# Altium project PA_Channel.PrjPcb
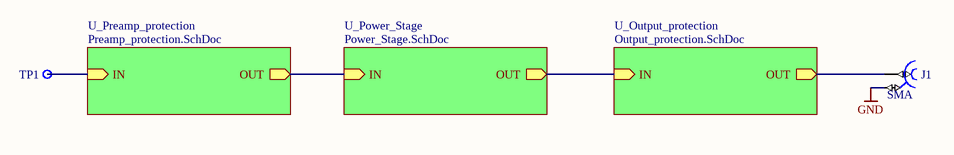
[diagram p0: PA_Channel.SchDoc]
4 sheets, 118 parts. Net scope: hierarchical (ports join the sheet entries above them; power ports are global).
Board file: PA_Channel_RF.PcbDoc
Sheets:
  PA_Channel.SchDoc
    U_Output_protection = Output_protection.SchDoc
    U_Power_Stage = Power_Stage.SchDoc
    U_Preamp_protection = Preamp_protection.SchDoc

## Sheet PA_Channel.SchDoc
size A4

### Parts
J1  SMA  [MOLEX_73251-2121]
TP1  Test Point  [TPS127]  (value not drawn)

### Sub-sheets
U_Output_protection = Output_protection.SchDoc: IN (in), OUT (out)
U_Power_Stage = Power_Stage.SchDoc: IN (in), OUT (out)
U_Preamp_protection = Preamp_protection.SchDoc: OUT (out), IN (in)

### Nets
GND: J1.2
NetC10_1: sheet U_Power_Stage/IN, sheet U_Preamp_protection/OUT
NetC26_1: TP1.1 ; sheet U_Preamp_protection/IN
NetCP1_1: sheet U_Output_protection/IN, sheet U_Power_Stage/OUT
NetCP1_2: J1.1 ; sheet U_Output_protection/OUT

### Library data of the parts
J1 = MOLEX_73251-2121: Part Description: 50 Ohm, SMA Edge Mount PCB, With Jam Nut And Lock Washer; Manufacturer: MOLEX; PressFit: No; Part Number: MOLEX_73251-2121; Component Kind: Standard; Component Type: Standard; Pin Count: 5; Family: SMA; Mounted: Yes; Socket: No; SMD: Yes; Sense: No; Status: None; Manufacturer Part Number: 73251-2121; ComponentHeight: 5.75mm; HelpURL: \\cern.ch\dfs\Applications\Altium\Datasheets\MOLEX_73251-2121.pdf; Author: CERN DEM JLC; CreateDate: 26.10.2016; LatestRevisionDate: 26.10.2016
TP1 = SMD_PAD_1.27X1.27MM: Part Description: 1.27mm x 1.27mm PCB Copper Area (SMD Test Point); Mounted: No; Part Number: SMD_PAD_1.27X1.27MM; Component Kind: Standard (No BOM); Component Type: Standard (No BOM); Pin Count: 1; Family: Test Point; Socket: No; SMD: Yes; Sense: No; Status: None; ComponentHeight: 0mm; HelpURL: Undefined; Author: CERN DEM JLC; CreateDate: 12.01.2008; LatestRevisionDate: 12.01.2008; PackageDescription: 1.27mm x 1.27mm PCB Copper Area (SMD Test Point)

## Sheet Output_protection.SchDoc
size A3
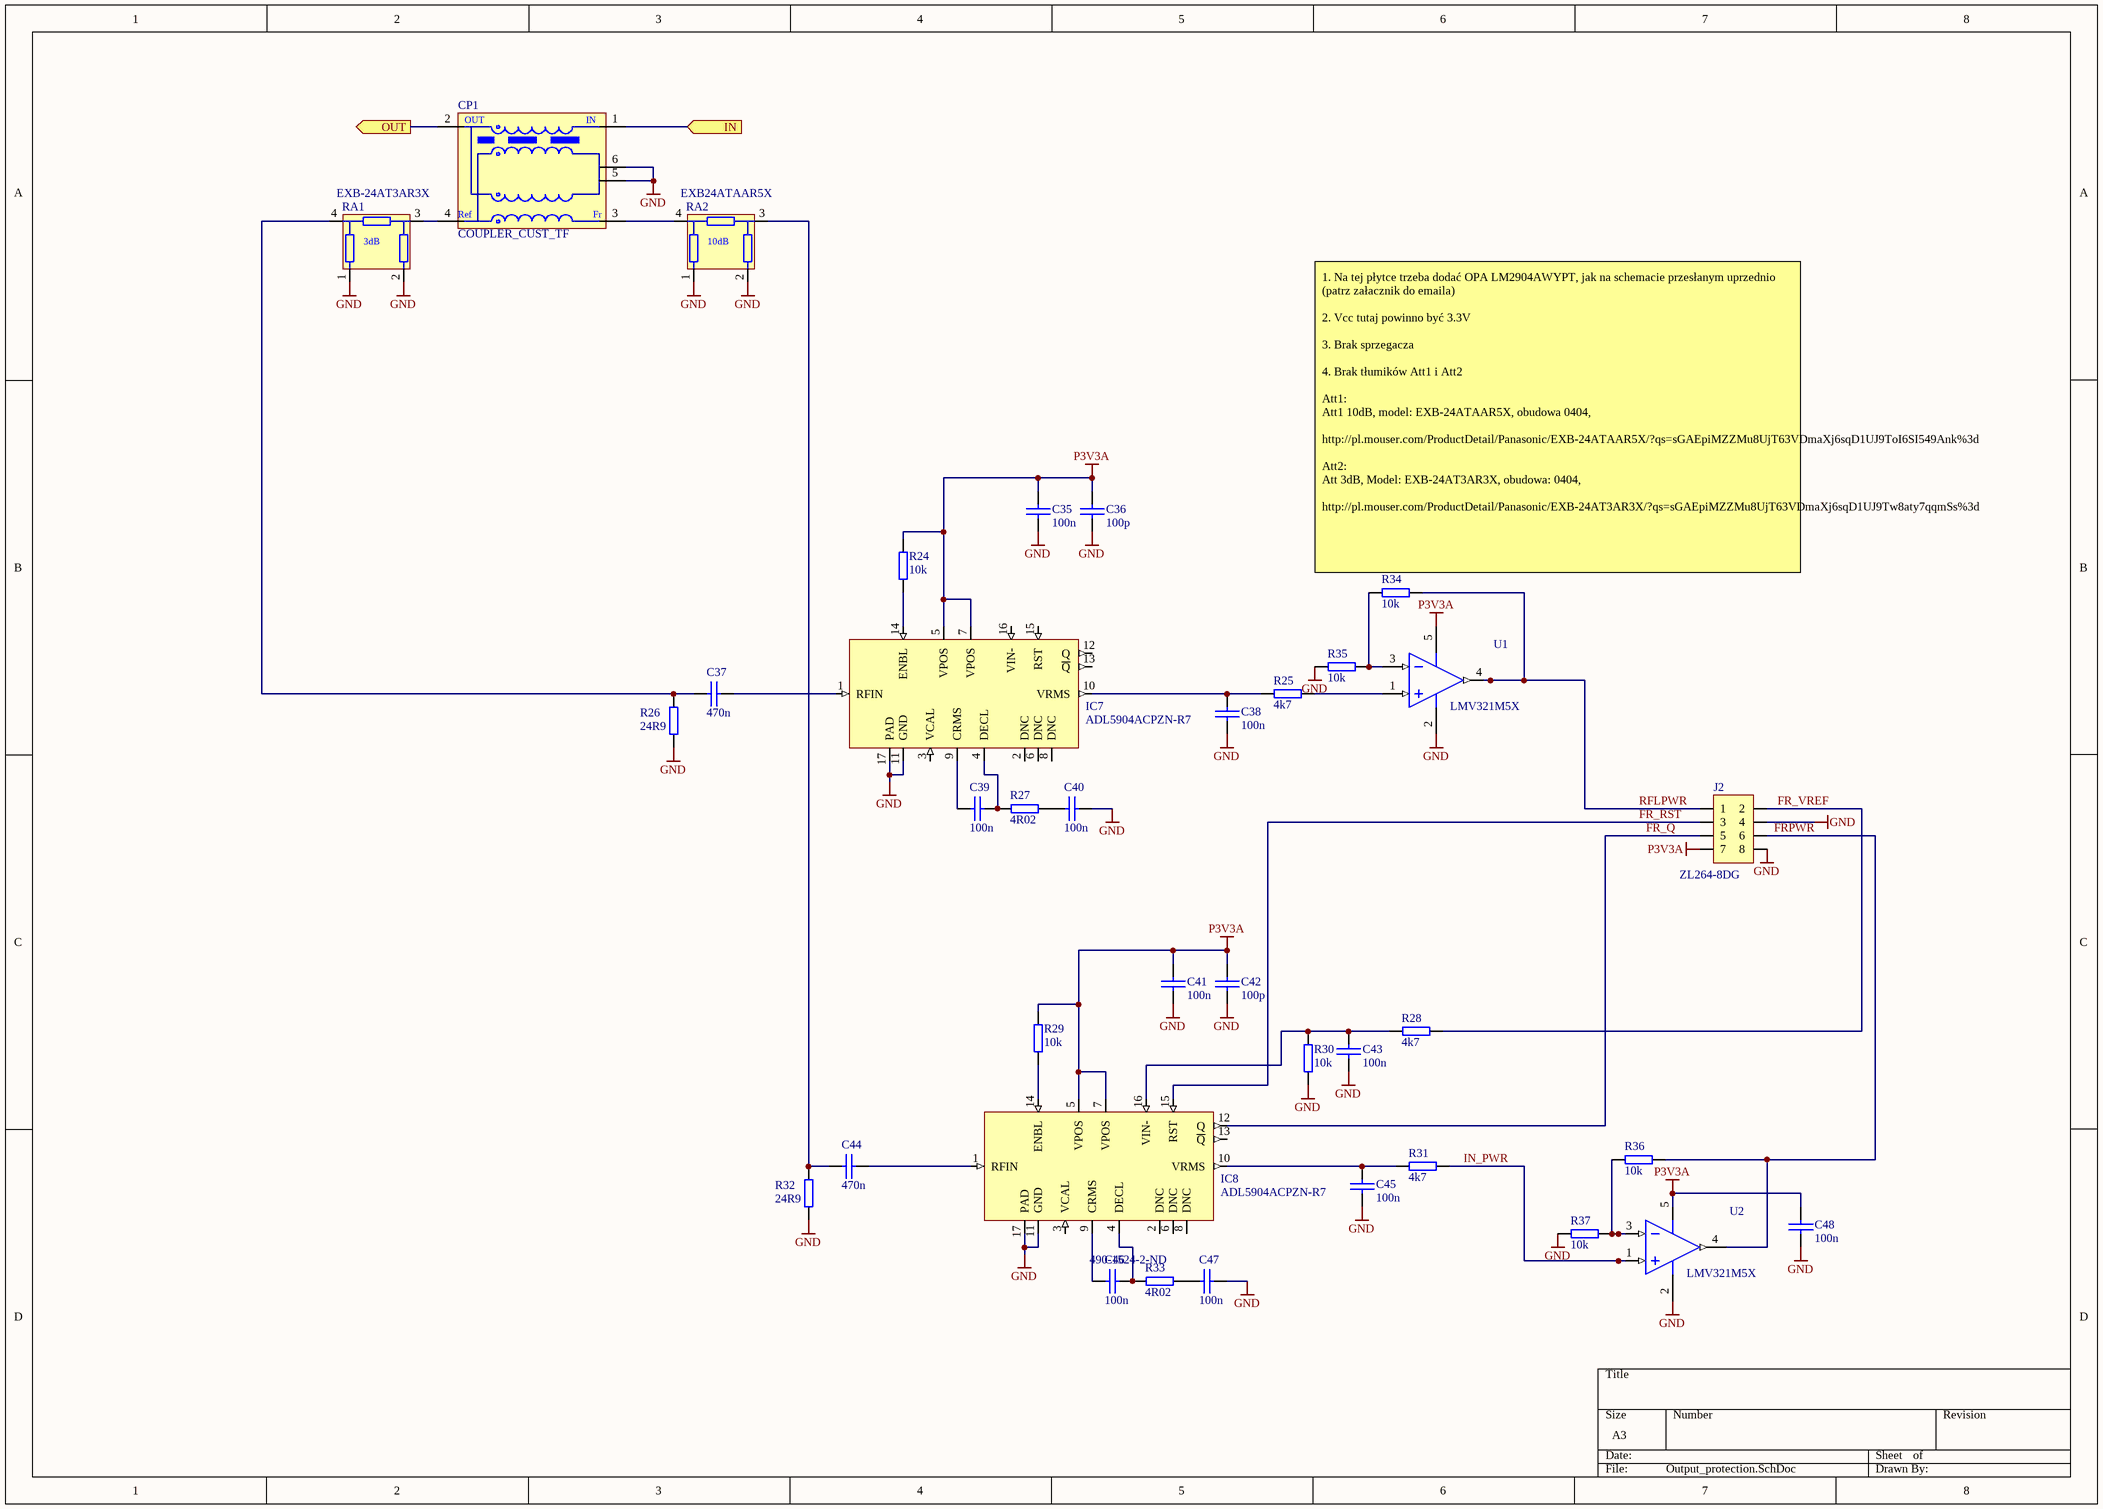
[diagram p1: Output_protection.SchDoc]

### Parts
C35  100n  [0603C]
C36  100p  [0603C]
C37  470n  [0603C]
C38  100n  [0603C]
C39  100n  [0603C]
C40  100n  [0603C]
C41  100n  [0603C]
C42  100p  [0603C]
C43  100n  [0603C]
C44  470n  [0603C]
C45  100n  [0603C]
C46  100n  Supplier Part Number 1: 490-1524-2-ND  [0603C]
C47  100n  [0603C]
C48  100n  [0603C]
CP1  COUPLER_CUST_TF  [COUPLER_CUST_TF]
IC7  ADL5904ACPZN-R7  [QFN50P300X300X80_HS-17N]
IC8  ADL5904ACPZN-R7  [QFN50P300X300X80_HS-17N]
J2  ZL264-8DG  [ZL264-8DG]
R24  10k  [0603R]
R25  4k7  [0603R]
R26  24R9  [0603R]
R27  4R02  [0603R]
R28  4k7  [0603R]
R29  10k  [0603R]
R30  10k  [0603R]
R31  4k7  [0603R]
R32  24R9  [0603R]
R33  4R02  [0603R]
R34  10k  [0603R]
R35  10k  [0603R]
R36  10k  [0603R]
R37  10k  [0603R]
RA1  EXB-24AT3AR3X  [CAC-65P100X100-4L]
RA2  EXB24ATAAR5X  [CAC-65P100X100-4L]
U1  LMV321M5X  [DBV0005A_N]
U2  LMV321M5X  [DBV0005A_N]

### Ports
IN (in), OUT (out)

### Nets
GND: C35.2 C36.2 C38.1 C40.2 C41.2 C42.2 C43.1 C45.1 C47.2 C48.1 CP1.5 CP1.6 IC7.11(GND) IC7.17(PAD) IC8.11(GND) IC8.17(PAD) J2.4 J2.8 R26.2 R30.1 R32.2 R35.2 R37.2 RA1.1 RA1.2 RA2.1 RA2.2 U1.2(V-) U2.2(V-)
P3V3A: C35.1 C36.1 C41.1 C42.1 C48.2 IC7.5(VPOS) IC7.7(VPOS) IC8.5(VPOS) IC8.7(VPOS) J2.7 R24.1 R29.1 U1.5(V+) U2.5(V+)
FR_Q: IC8.12(Q) J2.5
FR_RST: IC8.15(RST) J2.3
FR_VREF: J2.2 R28.1
FRPWR: J2.6 R36.1 U2.4(OUT)
IN_PWR: R31.1 U2.1(IN+)
RFLPWR: J2.1 R34.1 U1.4(OUT)
NetC37_1: C37.1 R26.1 RA1.4
NetC37_2: C37.2 IC7.1(RFIN)
NetC38_2: C38.2 IC7.10(VRMS) R25.2
NetC39_1: C39.1 IC7.9(CRMS)
NetC39_2: C39.2 IC7.4(DECL) R27.1
NetC40_1: C40.1 R27.2
NetC43_2: C43.2 IC8.16(VIN-) R28.2 R30.2
NetC44_1: C44.1 R32.1 RA2.3
NetC44_2: C44.2 IC8.1(RFIN)
NetC45_2: C45.2 IC8.10(VRMS) R31.2
NetC46_1: C46.1 IC8.9(CRMS)
NetC46_2: C46.2 IC8.4(DECL) R33.1
NetC47_1: C47.1 R33.2
NetCP1_1: CP1.1 ; port IN
NetCP1_2: CP1.2 ; port OUT
NetCP1_3: CP1.3 RA2.4
NetCP1_4: CP1.4 RA1.3
NetIC7_14: IC7.14(ENBL) R24.2
NetIC8_14: IC8.14(ENBL) R29.2
NetR25_1: R25.1 U1.1(IN+)
NetR34_2: R34.2 R35.1 U1.3(IN-)
NetR36_2: R36.2 R37.1 U2.3(IN-)

Not connected (* = marked no-connect by the designer): IC7 2(DNC) 3(VCAL) 6(DNC) 8(DNC) 12(Q) 13(~{Q}) 15(RST) 16(VIN-); IC8 2(DNC) 3(VCAL) 6(DNC) 8(DNC) 13(~{Q})

### Notes on the sheet
- (near R34) 1. Na tej płytce trzeba dodać OPA LM2904AWYPT, jak na schemacie przesłanym uprzednio
  (patrz załacznik do emaila)
  2. Vcc tutaj powinno być 3.3V
  3. Brak sprzegacza
  4. Brak tłumików Att1 i Att2
  Att1:
  Att1 10dB, model: EXB-24ATAAR5X, obudowa 0404,
  http://pl.mouser.com/ProductDetail/Panasonic/EXB-24ATAAR5X/?qs=sGAEpiMZZMu8UjT63VDmaXj6sqD1UJ9ToI6SI549Ank%3d
  Att2:
  Att 3dB, Model: EXB-24AT3AR3X, obudowa: 0404,
  http://pl.mouser.com/ProductDetail/Panasonic/EXB-24AT3AR3X/?qs=sGAEpiMZZMu8UjT63VDmaXj6sqD1UJ9Tw8aty7qqmSs%3d
- (in symbol IND_COUPLER_TF) OUT; IN; Ref; Fr
- (in symbol RES_ATT_3dB) 3dB
- (in symbol RES_ATT_10dB) 10dB

### Library data of the parts
C35 C38-C41 C43 C45-C48 = CAP_SMD_0603: Capacitor SMD; Part: GRM188L81H104KA93D
  C35 C38-C40 C43 C45 C47 C48: Supplier 1: Digi-Key
C36 C42 = CAP_SMD_0603: Capacitor SMD; Part: C1608NP01H101J080AA; Supplier 1: Digi-Key
C37 C44 = CAP_SMD_0603: Capacitor SMD; Part: GRM188R71A474KA61D; Supplier 1: Digi-Key
CP1 = IND_COUPLER_TF: custom coupler
IC7 IC8 = ADL5904: DC   to 6 GHz  , 45 dB DC  to 6 GHz , 45 dB TruPwr Detector with Envelope Threshold Detection
J2 = CON_2X4 2.54 SMT FEM: 2.54mm pitch connector
R24 R29 R30 R34-R37 = RES_0603: SMD Resistor; Part: CRCW060310K0FKEA; Supplier 1: Newark
  R29 R34-R37: Supplier Part Number 1: 39K0073
R25 R28 R31 = RES_0603: SMD Resistor; Part: CR0603-FX-4701ELF; Supplier 1: Newark; Supplier Part Number 1: 39K0073
R26 R32 = RES_0603: SMD Resistor; Part: CPF0603F24R9C1; Supplier 1: Newark
R27 = RES_0603: SMD Resistor; Part: CRCW06034R02FKEA; Supplier 1: Newark
R33 = RES_0603: SMD Resistor; Supplier 1: Newark; Supplier Part Number 1: 39K0073
RA1 = RES_ATT_3dB: 3dB Chip Attenuator
RA2 = RES_ATT_10dB: 10dB Chip Attenuator
U1 U2 = CMP-0055-01048-3: General Purpose, Low Voltage, Rail-to-Rail Output Operational Amplifiers, 5-pin SOT-23; Manufacturer: Texas Instruments; PackageTopMarking: A13*XTT; PowerWise: N; Package Reference: DBV0005A; PackageDescription: Molded SOT-23, .115 x .063 x .040 in Body, 5 Lead, .0375 in Pitch; CompType: Amplifiers; RoHS: N; ComponentLink1URL: http://www.ti.com/general/docs/lit/getliterature.tsp?genericPartNumber=LMV321-N&fileType=pdf; PinCount: 5; ComponentLink1Description: Datasheet URL

## Sheet Power_Stage.SchDoc
size A4
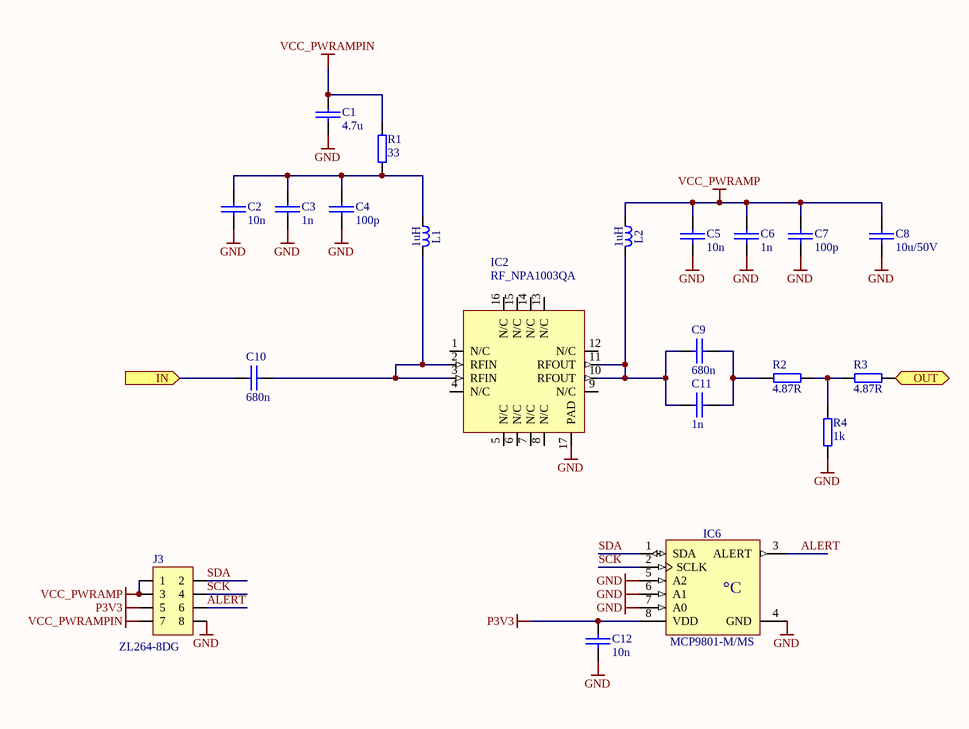
[diagram p2: Power_Stage.SchDoc]

### Parts
C1  4.7u  [0603C]
C2  10n  [0603C]
C3  1n  [0603C]
C4  100p  [0603C]
C5  10n  [0603C]
C6  1n  [0603C]
C7  100p  [0603C]
C8  10u/50V  [0805C]
C9  680n  [0603C]
C10  680n  [0603C]
C11  1n  [0603C]
C12  10n  [0603C]
IC2  RF_NPA1003QA  [QFN65P400X400X80_HS-17N]
IC6  MCP9801-M/MS  [SOP65P490X110-8N]
J3  ZL264-8DG  [ZL264-8DG]
L1  1uH  [INDP2520X18L]
L2  1uH  [INDP2520X18L]
R1  33  [0603R]
R2  4.87R  [0603R]
R3  4.87R  [0603R]
R4  1k  [0603R]

### Ports
IN (in), OUT (out)

### Nets
GND: C1.2 C2.2 C3.2 C4.2 C5.2 C6.2 C7.2 C8.2 C12.1 IC2.17(PAD) IC6.4(GND) IC6.5(A2) IC6.6(A1) IC6.7(A0) J3.8 R4.1
P3V3: C12.2 IC6.8(VDD) J3.5
VCC_PWRAMP: C5.1 C6.1 C7.1 C8.1 J3.1 J3.3 L2.1
VCC_PWRAMPIN: C1.1 J3.7 R1.2
ALERT: IC6.3(ALERT) J3.6
SCK: IC6.2(SCLK) J3.4
SDA: IC6.1(SDA) J3.2
NetC2_1: C2.1 C3.1 C4.1 L1.1 R1.1
NetC9_1: C9.1 C11.1 IC2.10(RFOUT) IC2.11(RFOUT) L2.2
NetC9_2: C9.2 C11.2 R2.1
NetC10_1: C10.1 ; port IN
NetC10_2: C10.2 IC2.2(RFIN) IC2.3(RFIN) L1.2
NetCP1_1: R3.2 ; port OUT
NetR2_2: R2.2 R3.1 R4.2

Not connected (* = marked no-connect by the designer): IC2 1(N/C) 4(N/C) 5(N/C) 6(N/C) 7(N/C) 8(N/C) 9(N/C) 12(N/C) 13(N/C) 14(N/C) 15(N/C) 16(N/C)

### Notes on the sheet
- (in symbol MCP9801-M/MS) °C

### Library data of the parts
C1 = CAP_SMD_0603: Capacitor SMD; Part: GRM21BR71C475KE51L; Supplier 1: Digi-Key; Supplier Part Number 1: 490-1524-2-ND
C2 C5 = CAP_SMD_0603: Capacitor SMD; Part: GRM1885C1H103JA01D; Supplier 1: Digi-Key; Supplier Part Number 1: 490-1524-2-ND
C3 C6 C11 = CAP_SMD_0603: Capacitor SMD; Part: GRM1885C1H102JA01D; Supplier 1: Digi-Key; Supplier Part Number 1: 490-1524-2-ND
C4 C7 = CAP_SMD_0603: Capacitor SMD; Part: C1608NP01H101J080AA; Supplier 1: Digi-Key; Supplier Part Number 1: 490-1524-2-ND
C8 = CAP_SMD_0805: Capacitor SMD; Part: GRM32ER71H106KA12L; Supplier 1: Farnell; Supplier Part Number 1: 1833812
C9 C10 = CAP_SMD_0603: Capacitor SMD; Part: GRM1555C1H681GA01; Supplier 1: Digi-Key; Supplier Part Number 1: 490-1524-2-ND
C12 = CAP_SMD_0603: Capacitor SMD; Supplier 1: Digi-Key; Supplier Part Number 1: 490-1524-2-ND
IC6 = MCP9801-M/MS: 2-Wire High-Accuracy Temperature Sensor; Manufacturer: MICROCHIP TECHNOLOGIY; PressFit: No; Bonding: No; Part Number: MCP9801-M/MS; Component Kind: Standard; Component Type: Standard; Device: MCP9801-M/MS; PackageDescription: SOP, 0.65mm pitch; 8 pin, 3.00mm W X 3.00mm L X 1.10mm H body, IPC Medium Density; Part Description: 2-Wire High-Accuracy Temperature Sensor; Manufacturer Part Number: MCP9801-M/MS; Pin Count: 8; Case: MSOP8; Mounted: Yes; Socket: No; SMD: Yes; Sense: No; ComponentHeight: 1.1mm; HelpURL: \\cern.ch\dfs\Applications\Altium\Datasheets\MCP9801-M-MS.pdf; Author: CERN DEM JLC; CreateDate: 18.11.2009; LatestRevisionDate: 18.11.2009
J3 = CON_2X4 2.54 SMT FEM: 2.54mm pitch connector
L1 = L_1008_100u: Part: LQW2UAS1R0J00L; Author: GK
L2 = L_1008_100u: 100uH, 60mA, 21R; Part: 1008LS-102XJLB; Author: GK
R1 = RES_0603: SMD Resistor; Part: CR0603-FX-33R0ELF; Supplier 1: Newark; Supplier Part Number 1: 39K0073
R2 R3 = RES_0603: SMD Resistor; Part: CPF0603B4R87E1; Supplier 1: Newark; Supplier Part Number 1: 39K0073
R4 = RES_0603: SMD Resistor; Part: RP73PF1J1K0BTDF; Supplier 1: Newark; Supplier Part Number 1: 39K0073

## Sheet Preamp_protection.SchDoc
size A4
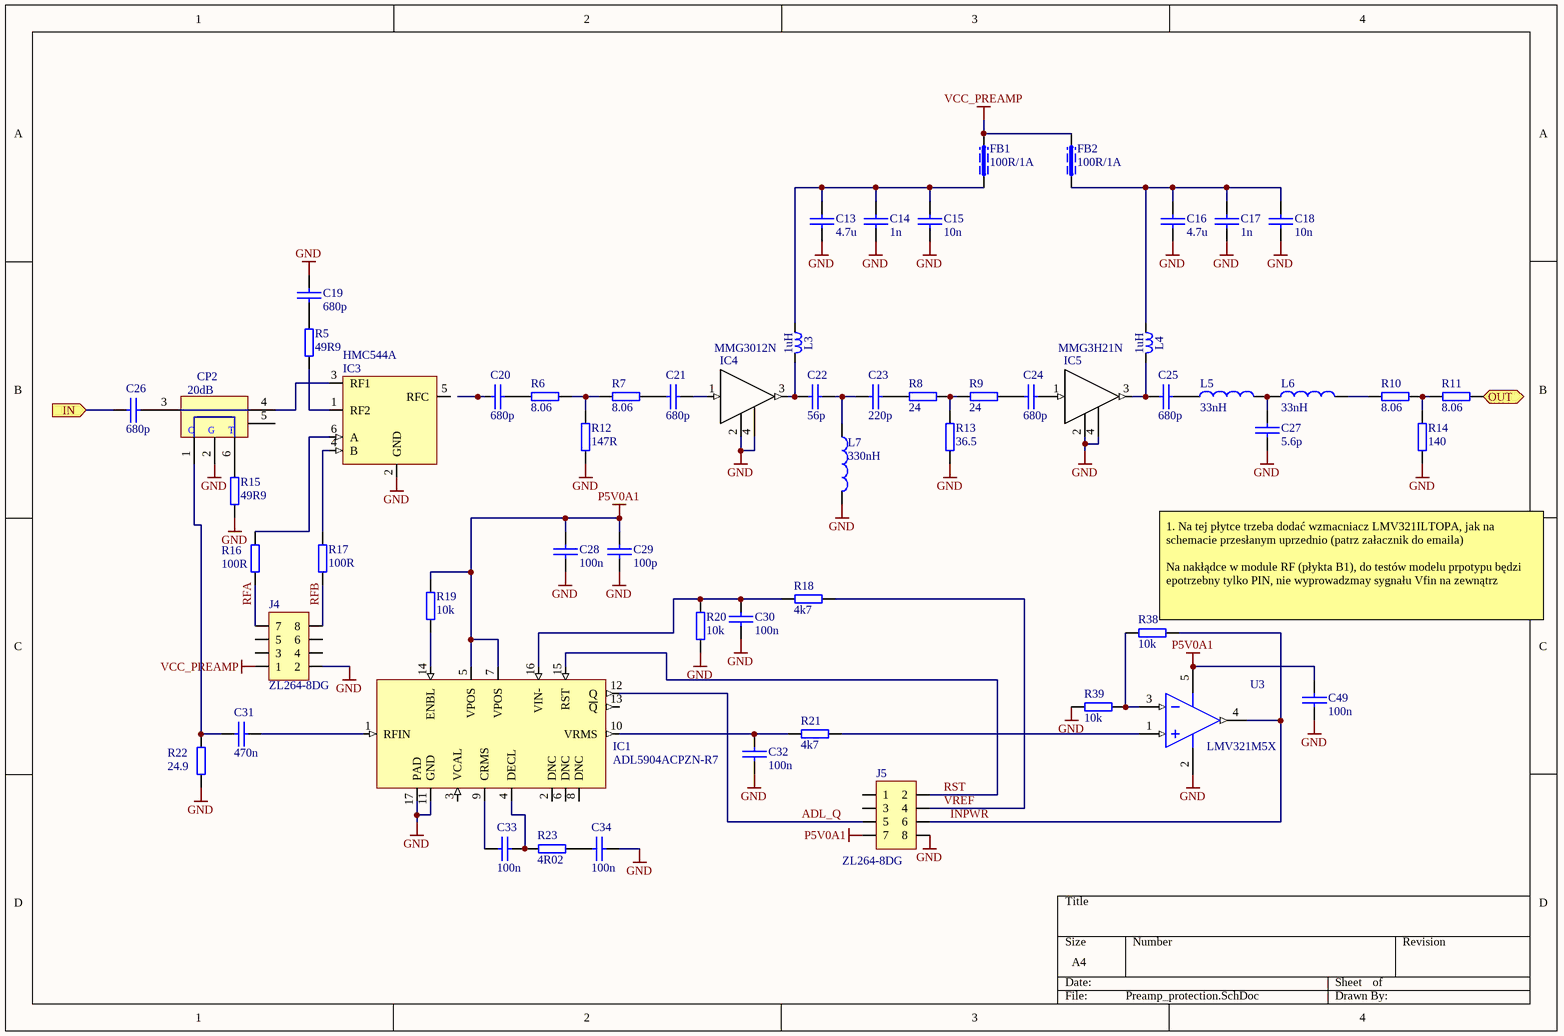
[diagram p3: Preamp_protection.SchDoc]

### Parts
C13  4.7u  [0603C]
C14  1n  [0603C]
C15  10n  [0603C]
C16  4.7u  [0603C]
C17  1n  [0603C]
C18  10n  [0603C]
C19  680p  [0603C]
C20  680p  [0603C]
C21  680p  [0603C]
C22  56p  [0603C]
C23  220p  [0603C]
C24  680p  [0603C]
C25  680p  [0603C]
C26  680p  [0603C]
C27  5.6p  [0603C]
C28  100n  [0603C]
C29  100p  [0603C]
C30  100n  [0603C]
C31  470n  [0603C]
C32  100n  [0603C]
C33  100n  [0603C]
C34  100n  [0603C]
C49  100n  [0603C]
CP2  20dB  [XFMR_MINI-CIRCUITS_AT224]
FB1  100R/1A  [0603L]
FB2  100R/1A  [0603L]
IC1  ADL5904ACPZN-R7  [QFN50P300X300X80_HS-17N]
IC3  HMC544A  [SOT95P280X130-6N]
IC4  MMG3012N  [SOT89-150P410X170-3N]
IC5  MMG3H21N  [SOT89-150P410X170-3N]
J4  ZL264-8DG  [ZL264-8DG]
J5  ZL264-8DG  [ZL264-8DG]
L3  1uH  [INDP2520X18L]
L4  1uH  [INDP2520X18L]
L5  33nH  [0603L]
L6  33nH  [0603L]
L7  330nH  [0603L]
R5  49R9  [0603R]
R6  8.06  [0603R]
R7  8.06  [0603R]
R8  24  [0603R]
R9  24  [0603R]
R10  8.06  [0603R]
R11  8.06  [0603R]
R12  147R  [0603R]
R13  36.5  [0603R]
R14  140  [0603R]
R15  49R9  [0603R]
R16  100R  [0603R]
R17  100R  [0603R]
R18  4k7  [0603R]
R19  10k  [0603R]
R20  10k  [0603R]
R21  4k7  [0603R]
R22  24.9  [0603R]
R23  4R02  [0603R]
R38  10k  [0603R]
R39  10k  [0603R]
U3  LMV321M5X  [DBV0005A_N]

### Ports
IN (in), OUT (out)

### Nets
GND: C13.2 C14.2 C15.2 C16.2 C17.2 C18.2 C19.2 C27.1 C28.2 C29.2 C30.1 C32.1 C34.2 C49.1 CP2.2(NC) IC1.11(GND) IC1.17(PAD) IC3.2(GND) IC4.2(G) IC4.4(G) IC5.2(G) IC5.4(G) J4.2 J5.8 L7.2 R12.1 R13.2 R14.2 R15.2 R20.1 R22.2 R39.2 U3.2(V-)
P5V0A1: C28.1 C29.1 C49.2 IC1.5(VPOS) IC1.7(VPOS) J5.7 R19.1 U3.5(V+)
VCC_PREAMP: FB1.2 FB2.2 J4.1
ADL_Q: IC1.12(Q) J5.5
INPWR: J5.6 R38.1 U3.4(OUT)
RFA: J4.7 R16.2
RFB: J4.8 R17.2
RST: IC1.15(RST) J5.2
VREF: J5.4 R18.1
NetC10_1: R11.1 ; port OUT
NetC13_1: C13.1 C14.1 C15.1 FB1.1 L3.1
NetC16_1: C16.1 C17.1 C18.1 FB2.1 L4.1
NetC19_1: C19.1 R5.1
NetC20_2: C20.2 R6.2
NetC21_1: C21.1 R7.1
NetC21_2: C21.2 IC4.1(IN)
NetC22_1: C22.1 IC4.3(OUT) L3.2
NetC22_2: C22.2 C23.1 L7.1
NetC23_2: C23.2 R8.2
NetC24_1: C24.1 R9.1
NetC24_2: C24.2 IC5.1(IN)
NetC25_1: C25.1 IC5.3(OUT) L4.2
NetC25_2: C25.2 L5.1
NetC26_1: C26.1 ; port IN
NetC26_2: C26.2 CP2.3(S)
NetC27_2: C27.2 L5.2 L6.1
NetC30_2: C30.2 IC1.16(VIN-) R18.2 R20.2
NetC31_1: C31.1 CP2.1(SDOT) R22.1
NetC31_2: C31.2 IC1.1(RFIN)
NetC32_2: C32.2 IC1.10(VRMS) R21.2
NetC33_1: C33.1 IC1.9(CRMS)
NetC33_2: C33.2 IC1.4(DECL) R23.1
NetC34_1: C34.1 R23.2
NetCP2_4: CP2.4(P) IC3.3(RF1)
NetCP2_6: CP2.6(PDOT) R15.1
NetIC1_14: IC1.14(ENBL) R19.2
NetIC3_1: IC3.1(RF2) R5.2
NetIC3_4: IC3.4(B) R17.1
NetIC3_6: IC3.6(A) R16.1
NetL6_2: L6.2 R10.2
NetR6_1: R6.1 R7.2 R12.2
NetR8_1: R8.1 R9.2 R13.1
NetR10_1: R10.1 R11.2 R14.1
NetR21_1: R21.1 U3.1(IN+)
NetR38_2: R38.2 R39.1 U3.3(IN-)

Not connected (* = marked no-connect by the designer): C20 1; CP2 5(P); IC1 2(DNC) 3(VCAL) 6(DNC) 8(DNC) 13(~{Q}); IC3 5(RFC); J4 3 4 5 6; J5 1 3

### Notes on the sheet
- (near R38) 1. Na tej płytce trzeba dodać wzmacniacz LMV321ILTOPA, jak na schemacie przesłanym uprzednio (patrz załacznik do emaila)
  Na nakłądce w module RF (płykta B1), do testów modelu prpotypu będzi epotrzebny tylko PIN, nie wyprowadzmay sygnału Vfin na zewnątrz
- (in symbol RF_Coupler_TCD-20-4X) C; G; T

### Library data of the parts
C13 C16 = CAP_SMD_0603: Capacitor SMD; Part: GRM21BR71C475KE51L; Supplier 1: Digi-Key; Supplier Part Number 1: 490-1524-2-ND
C14 C17 = CAP_SMD_0603: Capacitor SMD; Part: GRM1885C1H102JA01D; Supplier 1: Digi-Key; Supplier Part Number 1: 490-1524-2-ND
C15 C18 = CAP_SMD_0603: Capacitor SMD; Part: GRM1885C1H103JA01D; Supplier 1: Digi-Key; Supplier Part Number 1: 490-1524-2-ND
C19-C21 C24-C26 = CAP_SMD_0603: Capacitor SMD; Part: GRM1555C1H681GA01; Supplier 1: Digi-Key; Supplier Part Number 1: 490-1524-2-ND
C22 = CAP_SMD_0603: Capacitor SMD; Part: GRM1885C1H560GA01J; Supplier 1: Digi-Key; Supplier Part Number 1: 490-1524-2-ND
C23 = CAP_SMD_0603: Capacitor SMD; Part: GRM1885C1H221GA01D; Supplier 1: Digi-Key; Supplier Part Number 1: 490-1524-2-ND
C27 = CAP_SMD_0603: Capacitor SMD; Part: GQM1885C2A5R6BB01D; Supplier 1: Digi-Key; Supplier Part Number 1: 490-1524-2-ND
C28 C30 C32-C34 C49 = CAP_SMD_0603: Capacitor SMD; Part: GRM188L81H104KA93D; Supplier 1: Digi-Key
  C28 C30 C32-C34: Supplier Part Number 1: 490-1524-2-ND
C29 = CAP_SMD_0603: Capacitor SMD; Part: C1608NP01H101J080AA; Supplier 1: Digi-Key; Supplier Part Number 1: 490-1524-2-ND
C31 = CAP_SMD_0603: Capacitor SMD; Part: GRM188R71A474KA61D; Supplier 1: Digi-Key; Supplier Part Number 1: 490-1524-2-ND
CP2 = RF_Coupler_TCD-20-4X: 50 Ohms directional coupler; Part Number: XFMR_MINI-CIRCUITS_TCD-20-4X+; Part Description: 50 Ohms 4.5 To 3000MHz RF Transformer; Manufacturer: MINI-CIRCUITS; Manufacturer Part Number: TCD-20-4X+; Component Kind: Standard; Component Type: Standard; Pin Count: 5; Value: 20dB; Status: None; Mounted: Yes; Socket: No; Sense: No; SMD: Yes; ComponentHeight: 3.81mm; HelpURL: \\cern.ch\dfs\Applications\Altium\Datasheets\XFMR_MINI-CIRCUITS_TC1-1-13M+.pdf; Author: GK; CreateDate: 30.11.2011; LatestRevisionDate: 30.11.2011
FB1 FB2 = L_FERRITE_BEAD_0603: ferrite bead 100R@100MHz 1A; Supplier 1: Newark; Supplier Part Number 1: 89R3144
IC1 = ADL5904: as IC7 on sheet Output_protection
IC3 = RF_HMC544AE
IC4 = RF_MMG3012N: Broadband High Linearity Amplifier
IC5 = RF_MMG3H21N: Broadband High Linearity Amplifier
J4 J5 = CON_2X4 2.54 SMT FEM: 2.54mm pitch connector
L3 L4 = L_1008_100u: 100uH, 60mA, 21R; Part: LQW2UAS1R0J00L; Case: 1008; SMD: Yes; Author: GK
L5 L6 = L_0603_1uH: 1uH, 25mA, 0.6R; Part: LQW18AS33NG00D; Supplier 1: Newark; Supplier Part Number 1: 42M2122
L7 = L_0603_1uH: 1uH, 25mA, 0.6R; Part: LQW18ANR33G00D; Supplier 1: Newark; Supplier Part Number 1: 42M2122
R5 R15 = RES_0603: SMD Resistor; Part: MCT0603PD4999DP500; Supplier 1: Newark; Supplier Part Number 1: 39K0073
R6 R7 R10 R11 = RES_0603: SMD Resistor; Part: CPF0805B8R06E1; Supplier 1: Newark; Supplier Part Number 1: 39K0073
R8 R9 = RES_0603: SMD Resistor; Part: CPF0805B24RE1; Supplier 1: Newark; Supplier Part Number 1: 39K0073
R12 = RES_0603: SMD Resistor; Part: CPF0805B147RE1; Supplier 1: Newark; Supplier Part Number 1: 39K0073
R13 = RES_0603: SMD Resistor; Part: CPF0805B36R5E1; Supplier 1: Newark; Supplier Part Number 1: 39K0073
R14 = RES_0603: SMD Resistor; 140: CPF0805B147RE1; Supplier 1: Newark; Supplier Part Number 1: 39K0073
R16 R17 = RES_0603: SMD Resistor; Part: CRCW0603100RJNEA; Supplier 1: Newark; Supplier Part Number 1: 39K0073
R18 R21 = RES_0603: SMD Resistor; Part: CR0603-FX-4701ELF; Supplier 1: Newark; Supplier Part Number 1: 39K0073
R19 R20 R38 R39 = RES_0603: SMD Resistor; Part: CRCW060310K0FKEA; Supplier 1: Newark; Supplier Part Number 1: 39K0073
R22 = RES_0603: SMD Resistor; Part: CPF0603F24R9C1; Supplier 1: Newark; Supplier Part Number 1: 39K0073
R23 = RES_0603: SMD Resistor; Part: CRCW06034R02FKEA; Supplier 1: Newark; Supplier Part Number 1: 39K0073
U3 = CMP-0055-01048-3: as U1 on sheet Output_protection; Package Reference: DBV0005A; PackageDescription: Molded SOT-23, .115 x .063 x .040 in Body, 5 Lead, .0375 in Pitch; CompType: Amplifiers; RoHS: N; ComponentLink1URL: http://www.ti.com/general/docs/lit/getliterature.tsp?genericPartNumber=LMV321-N&fileType=pdf; PinCount: 5; ComponentLink1Description: Datasheet URL

## Nets that join several sheets
GND: PA_Channel (J1.2), Output_protection (29 pins), Power_Stage (16 pins), Preamp_protection (33 pins)
NetC10_1: Power_Stage (C10.1), Preamp_protection (R11.1)
NetC26_1: PA_Channel (TP1.1), Preamp_protection (C26.1)
NetCP1_1: Output_protection (CP1.1), Power_Stage (R3.2)
NetCP1_2: PA_Channel (J1.1), Output_protection (CP1.2)